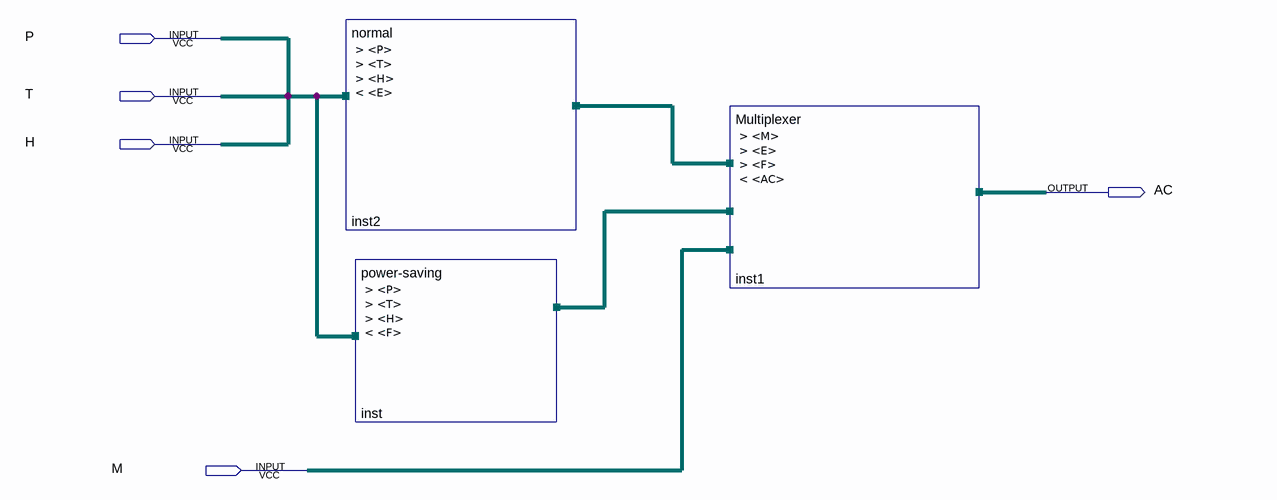
[diagram p0: schematic sheet]
// Quartus schematic lab4step3.bdf as structural Verilog: 3 symbols, 5 pins
module lab4step3 (
  input  P,
  input  T,
  input  H,
  input  M,
  output AC
);

  wire \<E> , \<F> , \<H> , \<P> , \<T> ;

  normal inst2 (.\<P> (\<P> ), .\<T> (\<T> ), .\<H> (\<H> ), .\<E> (\<E> ));
  \power-saving  inst (.\<P> (\<P> ), .\<T> (\<T> ), .\<H> (\<H> ), .\<F> (\<F> ));
  Multiplexer inst1 (.\<E> (\<E> ), .\<F> (\<F> ));  // open: <M>, <AC>
endmodule
